# EAGLE schematic Universal Flight Computer Mk1 (EAGLE 9.0.1)

## Sheet 1 of 2
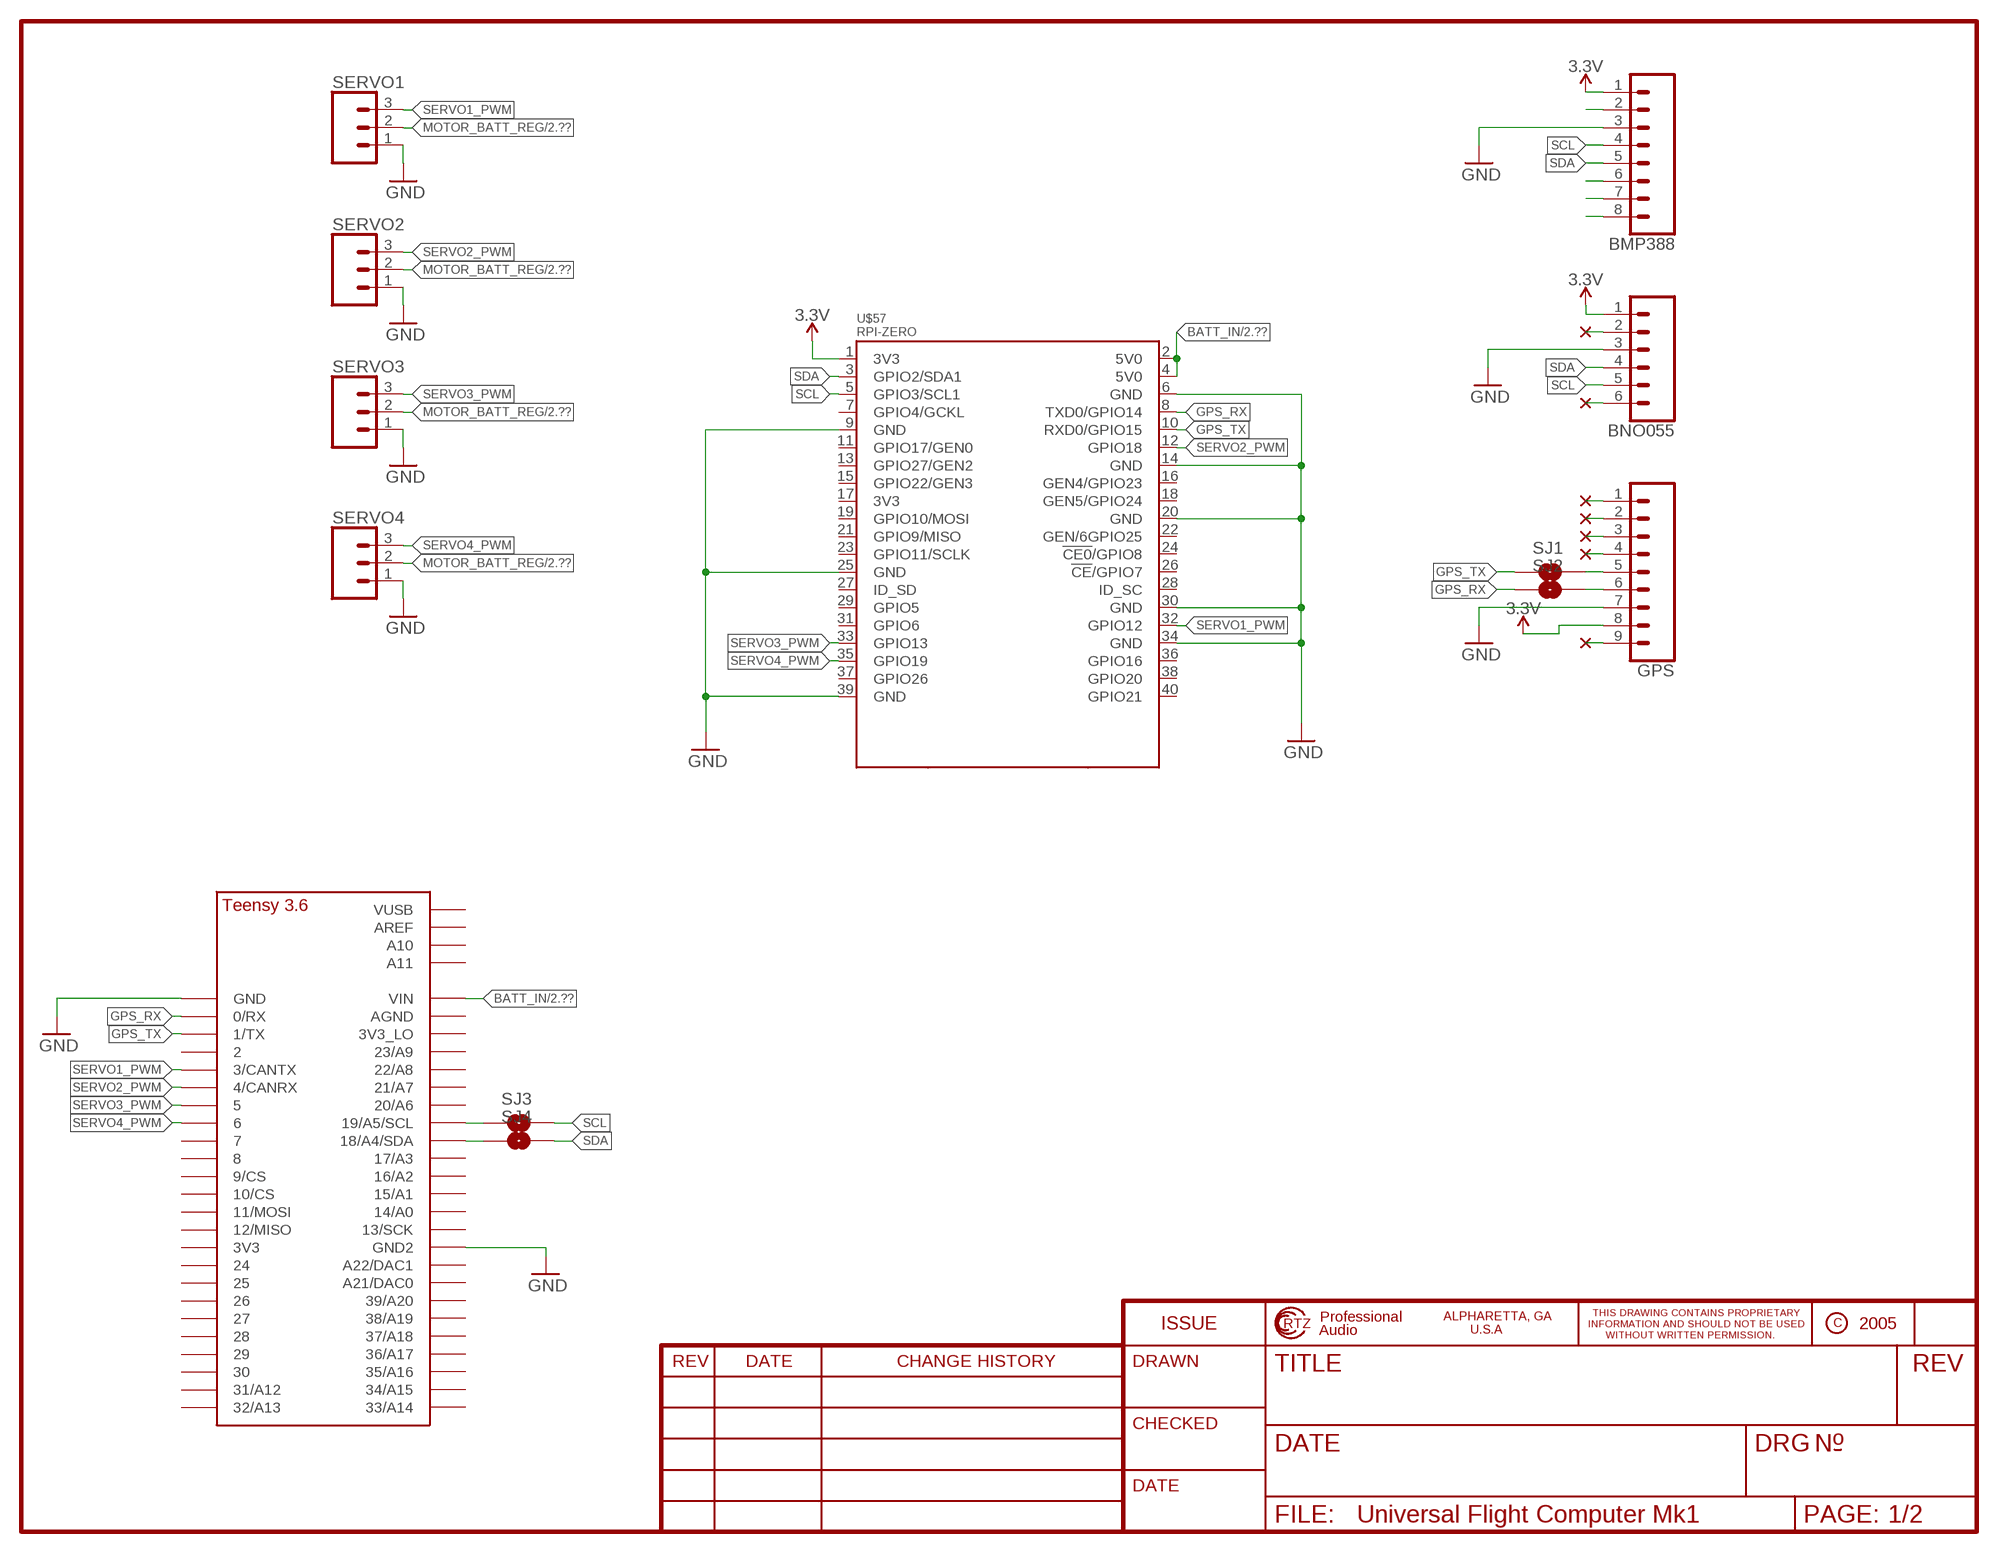
[diagram p0: schematic, sheet 1]

### Parts
BMP388  CONN_08"  [1X08]
BNO055  CONN_06SILK_FEMALE_PTH  [1X06]
GPS  CONN_09  [1X09]
SERVO1  CONN_03  [1X03]
SERVO2  CONN_03  [1X03]
SERVO3  CONN_03  [1X03]
SERVO4  CONN_03  [1X03]
SJ1  SOLDERJUMPERNO  [SJ_2S-NO]
SJ2  SOLDERJUMPERNO  [SJ_2S-NO]
SJ3  SOLDERJUMPERNO  [SJ_2S-NO]
SJ4  SOLDERJUMPERNO  [SJ_2S-NO]
U$5  NC  [NC]
U$6  NC  [NC]
U$7  NC  [NC]
U$8  NC  [NC]
U$9  NC  [NC]
U$10  NC  [NC]
U$11  NC  [NC]
U$12  TEENSY_3.5/3.6_BASIC  [TEENSY_3.5/3.6_BASIC]
U$57  RPI-ZERO  [RASPBERRYPI_BASTELSTUBE_V13_RASPI_BOARD_B+_FULL]

### Nets
3.3V: BMP388.1 BNO055.1 GPS.8 U$57.1(3V3)
BATT_IN: U$12.VIN U$57.2(5V0) U$57.4(5V0) ; also sheet 2
BMP_CS: BMP388.7
BMP_INT: BMP388.8
BMP_SDI: BMP388.6
GND: BMP388.3 BNO055.3 GPS.7 SERVO1.1 SERVO2.1 SERVO3.1 SERVO4.1 U$12.GND U$12.GND2 U$57.6(GND) U$57.9(GND) U$57.14(GND) U$57.20(GND) U$57.25(GND) U$57.30(GND) U$57.34(GND) U$57.39(GND) ; also sheet 2
GPS_RX: GPS.6 SJ2.1 SJ2.2 U$12.0/RX U$57.8(TXD0/GPIO14)
GPS_TX: GPS.5 SJ1.1 SJ1.2 U$12.1/TX U$57.10(RXD0/GPIO15)
MOTOR_BATT_REG [IGNITER_BATT_REG]: SERVO1.2 SERVO2.2 SERVO3.2 SERVO4.2 ; also sheet 2
N$1: BMP388.2
N$2: BNO055.2
N$3: GPS.1
N$4: GPS.2
N$5: GPS.3
N$6: BNO055.6
N$7: GPS.4
N$8: GPS.9
N$9: SJ3.1 U$12.19/A5/SCL
N$10: SJ4.1 U$12.18/A4/SDA
SCL: BMP388.4 BNO055.5 SJ3.2 U$57.5(GPIO3/SCL1)
SDA: BMP388.5 BNO055.4 SJ4.2 U$57.3(GPIO2/SDA1)
SERVO1_PWM: SERVO1.3 U$12.3/CANTX U$57.32(GPIO12)
SERVO2_PWM: SERVO2.3 U$12.4/CANRX U$57.12(GPIO18)
SERVO3_PWM: SERVO3.3 U$12.5 U$57.33(GPIO13)
SERVO4_PWM: SERVO4.3 U$12.6 U$57.35(GPIO19)
Unconnected: U$12.2 U$12.3V3 U$12.3V3_LO U$12.7 U$12.8 U$12.9/CS U$12.10/CS U$12.11/MOSI U$12.12/MISO U$12.13/SCK U$12.14/A0 U$12.15/A1 U$12.16/A2 U$12.17/A3 U$12.20/A6 U$12.21/A7 U$12.21/DAC0(A21/DAC0) U$12.22/A8 U$12.23/A9 U$12.24 U$12.25 U$12.26 U$12.27 U$12.28 U$12.29 U$12.30 U$12.31/A12 U$12.32/A13 U$12.33/A14 U$12.34/A15 U$12.35/A16 U$12.36/A17 U$12.37/A18 U$12.38/A19 U$12.39/A20 U$12.A10 U$12.A11 U$12.A22/DAC1 U$12.AGND U$12.AREF U$12.VUSB U$57.7(GPIO4/GCKL) U$57.11(GPIO17/GEN0) U$57.13(GPIO27/GEN2) U$57.15(GPIO22/GEN3) U$57.16(GEN4/GPIO23) U$57.17(3V3) U$57.18(GEN5/GPIO24) U$57.19(GPIO10/MOSI) U$57.21(GPIO9/MISO) U$57.22(GEN/6GPIO25) U$57.23(GPIO11/SCLK) U$57.24(!CE0!/GPIO8) U$57.26(!CE!/GPIO7) U$57.27(ID_SD) U$57.28(ID_SC) U$57.29(GPIO5) U$57.31(GPIO6) U$57.36(GPIO16) U$57.37(GPIO26) U$57.38(GPIO20) U$57.40(GPIO21)

## Sheet 2 of 2
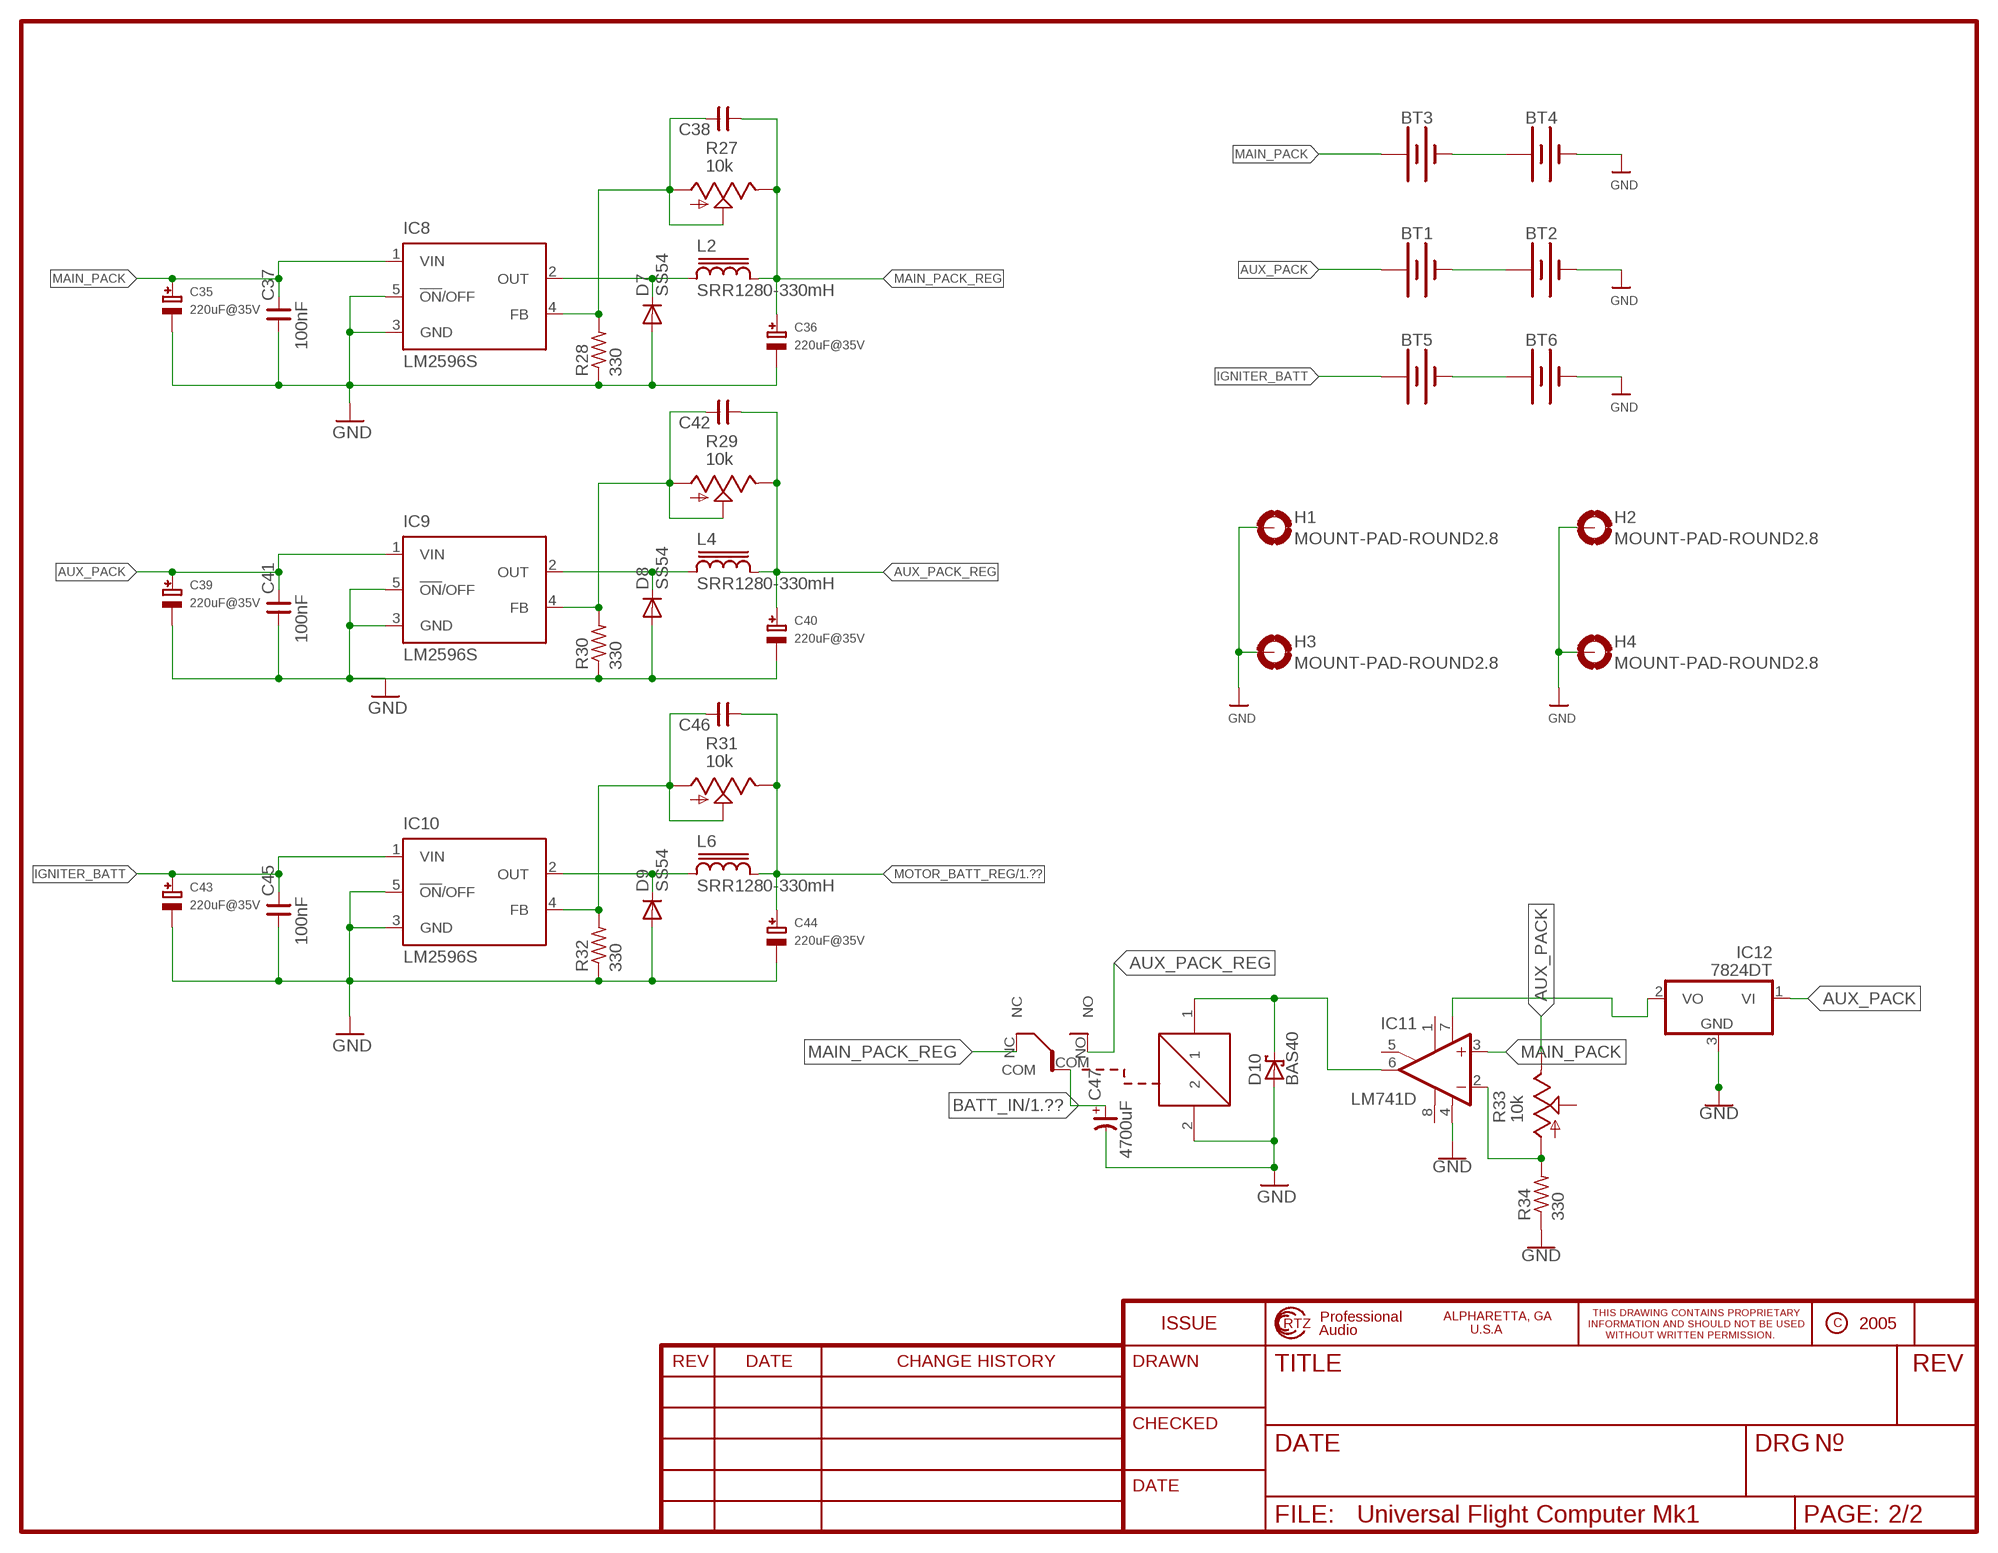
[diagram p1: schematic, sheet 2]

### Parts
BT1  BATTERY-18650  [BATTERY_18650-HOLDER]
BT2  BATTERY-18650  [BATTERY_18650-HOLDER]
BT3  BATTERY-18650  [BATTERY_18650-HOLDER]
BT4  BATTERY-18650  [BATTERY_18650-HOLDER]
BT5  BATTERY-18650  [BATTERY_18650-HOLDER]
BT6  BATTERY-18650  [BATTERY_18650-HOLDER]
C35  220uF@35V  CAP_ELECTROLYTICPANASONIC_D  [PANASONIC_D]
C36  220uF@35V  CAP_ELECTROLYTICPANASONIC_D  [PANASONIC_D]
C37  100nF  CNP-0603  [0603]
C38  CNP-0603  [0603]
C39  220uF@35V  CAP_ELECTROLYTICPANASONIC_D  [PANASONIC_D]
C40  220uF@35V  CAP_ELECTROLYTICPANASONIC_D  [PANASONIC_D]
C41  100nF  CNP-0603  [0603]
C42  CNP-0603  [0603]
C43  220uF@35V  CAP_ELECTROLYTICPANASONIC_D  [PANASONIC_D]
C44  220uF@35V  CAP_ELECTROLYTICPANASONIC_D  [PANASONIC_D]
C45  100nF  CNP-0603  [0603]
C46  CNP-0603  [0603]
C47  4700uF  CP-E-025X065  [E-025X065]
D7  SS54  S3G  [DO214AB]
D8  SS54  S3G  [DO214AB]
D9  SS54  S3G  [DO214AB]
D10  BAS40  [SOT23]
H1  MOUNT-PAD-ROUND2.8  [2,8-PAD]
H2  MOUNT-PAD-ROUND2.8  [2,8-PAD]
H3  MOUNT-PAD-ROUND2.8  [2,8-PAD]
H4  MOUNT-PAD-ROUND2.8  [2,8-PAD]
IC8  LM2596S  [TO263-5]
IC9  LM2596S  [TO263-5]
IC10  LM2596S  [TO263-5]
IC11  LM741D  [SO08]
IC12  7824DT  [TO252]
L2  SRR1280-330mH  SRR1280  [SRR1280]
L4  SRR1280-330mH  SRR1280  [SRR1280]
L6  SRR1280-330mH  SRR1280  [SRR1280]
R27  10k  TRIM_US-S64W  [S64W]
R28  330  R-US_R0603  [R0603]
R29  10k  TRIM_US-S64W  [S64W]
R30  330  R-US_R0603  [R0603]
R31  10k  TRIM_US-S64W  [S64W]
R32  330  R-US_R0603  [R0603]
R33  10k  TRIM_US-S64W  [S64W]
R34  330  R-US_R0603  [R0603]
U$54  RW-SH  [RW-SH]

### Nets
AUX_PACK [AUX_PACK]: BT1.PWR@1(+) C39.+ C41.2 IC9.1(VIN) IC12.1(VI) R33.E
AUX_PACK_REG [AUX_PACK_REG]: C40.+ C42.1 L4.2 R29.E U$54.NO
BATT_IN: C47.+ D10.3(C) IC11.6(OUT) U$54.1 U$54.COM ; also sheet 1
GND: BT2.GND@1(-) BT4.GND@1(-) BT6.GND@1(-) C39.- C40.- C41.1 C43.- C44.- C45.1 D8.A D9.A D10.1(A) H1.B2,8(MOUNT) H2.B2,8(MOUNT) H3.B2,8(MOUNT) H4.B2,8(MOUNT) IC9.3(GND) IC9.5(!ON!/OFF) IC10.3(GND) IC10.5(!ON!/OFF) IC11.4(V-) IC12.3(GND) R30.1 R32.1 R34.1 U$54.2 ; also sheet 1
IGNITER_BATT [IGNITER_BATT]: BT5.PWR@1(+) C43.+ C45.2 IC10.1(VIN)
MAIN_PACK [MAIN_PACK]: BT3.PWR@1(+) C35.+ C35.- C36.- C37.1 C37.2 D7.A IC8.1(VIN) IC8.3(GND) IC8.5(!ON!/OFF) IC11.3(+IN) R28.1 ; supply symbol labelled GND
MAIN_PACK_REG [MAIN_PACK_REG]: C36.+ C38.1 L2.2 R27.E U$54.NC
MOTOR_BATT_REG [IGNITER_BATT_REG]: C44.+ C46.1 L6.2 R31.E ; also sheet 1
N$43: BT3.GND@1(-) BT4.PWR@1(+)
N$44: BT1.GND@1(-) BT2.PWR@1(+)
N$56: D7.C IC8.2(OUT) L2.1
N$59: C38.2 IC8.4(FB) R27.A R27.S R28.2
N$63: D8.C IC9.2(OUT) L4.1
N$68: C42.2 IC9.4(FB) R29.A R29.S R30.2
N$69: D9.C IC10.2(OUT) L6.1
N$70: C46.2 IC10.4(FB) R31.A R31.S R32.2
N$71: IC11.2(-IN) R33.A R34.2
N$72: IC11.7(V+) IC12.2(VO)
N$73: BT5.GND@1(-) BT6.PWR@1(+)
Unconnected: C47.- IC11.1(ON1) IC11.5(ON2) IC11.8(OPT) R33.S

## Library data of the parts
BMP388 = SparkFun-Connectors:CONN_08: Multi connection point. Often used as Generic Header-pin footprint for 0.1 inch spaced/style header connections On any of the 0.1 inch spaced packages, you can populate with these: Break Away Headers - Straight <https://www.sparkfun.com/products/116> (PRT-00116) Break Away Male Headers - Right Angle <https://www.sparkfun.com/products/553> (PRT-00553) Female Headers <https://www.sparkfun.com/products/115> (PRT-00115) Break Away Headers - Machine Pin <https://www.sparkfun.com/products/117> (PRT-00117) Break Away Female Headers - Swiss Machine Pin <https://www.sparkfun.com/products/743> (PRT-00743) Arduino Stackable Header - 8 Pin <https://www.sparkfun.com/products/9279> (PRT-09279) For SCREWTERMINALS and SPRING TERMINALS visit here: Screw Terimnals on SparkFun.com <https://www.sparkfun.com/search/results?term=Screw+Terminals> (5mm/3.5mm/2.54mm spacing) This device is also useful as a general connection point to wire up your design to another part of your project. Our various solder wires solder well into these plated through hole pads. Hook-Up Wire - Assortment (Stranded, 22 AWG) <https://www.sparkfun.com/products/11375> (PRT-11375) Hook-Up Wire - Assortment (Solid Core, 22 AWG) <https://www.sparkfun.com/products/11367> (PRT-11367) View the entire wire category on our website here <https://www.sparkfun.com/categories/141> Special notes: Molex polarized connector foot print use with SKU : PRT-08231 with associated crimp pins and housings. 1MM SMD Version SKU: PRT-10208 NOTES ON THE VARIANTS LOCK and LOCK_LONGPADS... This footprint was designed to help hold the alignment of a through-hole component (i.e. 6-pin header) while soldering it into place. You may notice that each hole has been shifted either up or down by 0.005 of an inch from it's more standard position (which is a perfectly straight line). This slight alteration caused the pins (the squares in the middle) to touch the edges of the holes. Because they are alternating, it causes a "brace" to hold the component in place. 0.005 has proven to be the perfect amount of "off-center" position when using our standard breakaway headers. Although looks a little odd when you look at the bare footprint, once you have a header in there, the alteration is very hard to notice. Also,if you push a header all the way into place, it is covered up entirely on the bottom side.; PROD_ID: CONN-08438
BNO055 = SparkFun-Connectors:CONN_06: Multi connection point. Often used as Generic Header-pin footprint for 0.1 inch spaced/style header connections On any of the 0.1 inch spaced packages, you can populate with these: Break Away Headers - Straight <https://www.sparkfun.com/products/116> (PRT-00116) Break Away Male Headers - Right Angle <https://www.sparkfun.com/products/553> (PRT-00553) Female Headers <https://www.sparkfun.com/products/115> (PRT-00115) Break Away Headers - Machine Pin <https://www.sparkfun.com/products/117> (PRT-00117) Break Away Female Headers - Swiss Machine Pin <https://www.sparkfun.com/products/743> (PRT-00743) Arduino Stackable Header - 6 Pin <https://www.sparkfun.com/products/9280> (PRT-09280) For SCREWTERMINALS and SPRING TERMINALS visit here: Screw Terimnals on SparkFun.com <https://www.sparkfun.com/search/results?term=Screw+Terminals> (5mm/3.5mm/2.54mm spacing) This device is also useful as a general connection point to wire up your design to another part of your project. Our various solder wires solder well into these plated through hole pads. Hook-Up Wire - Assortment (Stranded, 22 AWG) <https://www.sparkfun.com/products/11375> (PRT-11375) Hook-Up Wire - Assortment (Solid Core, 22 AWG) <https://www.sparkfun.com/products/11367> (PRT-11367) View the entire wire category on our website here <https://www.sparkfun.com/categories/141>; PROD_ID: CONN-08437
BT1-BT6 = SparkFun-Batteries:BATTERY: Battery - Single Cell A variety of battery chemistries, sizes, and footprints. Device List: 20MM_PTH - Coin Cell Battery Holder - 20mm (PTH) <https://www.sparkfun.com/products/783> 6.8MM_PTH - Coin Cell Battery Holder - 6.8MM(SMD) <https://www.digikey.com/product-detail/en/seiko-instruments/MS621FE-FL11E/728-1057-ND/1889208?WT.srch=1&gclid=CNOQ5a6LzdQCFZS2wAodXCkE0g> 12MM_SMD - Coin Cell Battery Holder - 12mm (SMD) <https://www.sparkfun.com/products/10592> 12MM_PTH - Coin Cell Battery Holder - 12mm (PTH) <https://www.sparkfun.com/products/7948> 20MM_SMD - 20mm Coin Cell Battery Holder (SMD) (2 legs) Used on the Big Time Watch Kit <https://www.sparkfun.com/products/11734> 20MM_SMD_4LEGS - Coin Cell Battery Holder - 20mm (SMD) <https://www.sparkfun.com/products/11892> 20MM_SMD_4LEGS_OVERPASTE - Coin Cell Battery Holder - 20mm (SMD) <https://www.sparkfun.com/products/11892> (Over-paste on the legs) 24.5MM_PTH - Coin Cell Battery Holder - 24.5mm (PTH) <https://www.sparkfun.com/products/8863> 9V - 9V Battery Holder - PC Mount Used on the SparkFun SparkPunk Sound Kit <https://www.sparkfun.com/products/11177> and SparkFun SparkPunk Sequencer Kit <https://www.sparkfun.com/products/12707> 18650 - Battery Holder - 18650 (PTH) <https://www.sparkfun.com/products/13113> AA - Battery Holder - 1xAA (PTH) <https://www.sparkfun.com/products/7949> AAA - Battery Holder - 1xAAA (PTH) <https://www.sparkfun.com/products/12718> AA_KIT - Battery Holder - 1xAA (PTH) <https://www.sparkfun.com/products/7949> Special kit package - pads only have exposed copper on one side of the board. AAA_KIT - Battery Holder - 1xAAA (PTH) <https://www.sparkfun.com/products/12718> Special kit package - pads only have exposed copper on one side of the board.; PROD_ID: BATT-12327; SF_SKU: PRT-13113
C35 C36 C39 C40 C43 C44 = microbuilder:CAP_ELECTROLYTIC: Electrolytic Capacitors PANASONIC_C - Size C Panasonic Electrolytic Aluminum Capacitor 47µF 16V 20% Electrolytic Capacitor [Digikey: PCE3890TR-ND] PANASONIC_D - Size D Panasonic Electrolytic Aluminum Capacitor 100µF 25V 20% Electrolytic Capacitor [Digikey: PCE3898TR-ND]
C37 C38 C41 C42 C45 C46 = cap-master:CNP-: NON-POLARIZED CAP
C47 = cap-master:CP-: POLARIZED CAP
D7-D9 = s3x_10:S3*: S3A - S3N General Purpose Rectifiers Source: http://www.fairchildsemi.com/datasheets/S3/S3A.pdf; MF: Fairchild; MPN: S3G; OC_FARNELL: 2454094; OC_NEWARK: 58K2397
D10 = diode:BAS40: Silicon Schottky Diodes General-purpose diode for high-speed switching
GPS = SparkFun-Connectors:CONN_09: Multi connection point. Often used as Generic Header-pin footprint for 0.1 inch spaced/style header connections On any of the 0.1 inch spaced packages, you can populate with these: Break Away Headers - Straight <https://www.sparkfun.com/products/116> (PRT-00116) Break Away Male Headers - Right Angle <https://www.sparkfun.com/products/553> (PRT-00553) Female Headers <https://www.sparkfun.com/products/115> (PRT-00115) Break Away Headers - Machine Pin <https://www.sparkfun.com/products/117> (PRT-00117) Break Away Female Headers - Swiss Machine Pin <https://www.sparkfun.com/products/743> (PRT-00743) For SCREWTERMINALS and SPRING TERMINALS visit here: Screw Terimnals on SparkFun.com <https://www.sparkfun.com/search/results?term=Screw+Terminals> (5mm/3.5mm/2.54mm spacing) This device is also useful as a general connection point to wire up your design to another part of your project. Our various solder wires solder well into these plated through hole pads. Hook-Up Wire - Assortment (Stranded, 22 AWG) <https://www.sparkfun.com/products/11375> (PRT-11375) Hook-Up Wire - Assortment (Solid Core, 22 AWG) <https://www.sparkfun.com/products/11367> (PRT-11367) View the entire wire category on our website here <https://www.sparkfun.com/categories/141> Special notes: Molex polarized connector foot print use with SKU : PRT-08231 with associated crimp pins and housings. 1MM SMD Version SKU: PRT-10208 NOTES ON THE VARIANTS LOCK and LOCK_LONGPADS... This footprint was designed to help hold the alignment of a through-hole component (i.e. 6-pin header) while soldering it into place. You may notice that each hole has been shifted either up or down by 0.005 of an inch from it's more standard position (which is a perfectly straight line). This slight alteration caused the pins (the squares in the middle) to touch the edges of the holes. Because they are alternating, it causes a "brace" to hold the component in place. 0.005 has proven to be the perfect amount of "off-center" position when using our standard breakaway headers. Although looks a little odd when you look at the bare footprint, once you have a header in there, the alteration is very hard to notice. Also,if you push a header all the way into place, it is covered up entirely on the bottom side.
H1-H4 = holes:MOUNT-PAD-ROUND: MOUNTING PAD, round
IC8-IC10 = national-semiconductor:LM2596: SIMPLE SWITCHER® Power Converter 150 kHz 3A Step-Down Voltage Regulator Source: http://www.national.com/ds/LM/LM2596.pdf; MF: NATIONAL SEMICONDUCTOR; MPN: LM2596S-ADJ/NOPB; OC_FARNELL: 9494367; OC_NEWARK: 41K3842
IC11 = linear:*741: OP AMP
IC12 = linear:78*: Positive VOLTAGE REGULATOR Source: http://cache.national.com/ds/LM/LM78L05.pdf http://www.fairchildsemi.com/ds/LM/LM7805.pdf
L2 L4 L6 = inductor-bourns:SRR1280: POWER INDUCTOR
R27 R29 R31 R33 = pot:TRIM_US-: POTENTIOMETER
R28 R30 R32 R34 = adafruit:R-US_: RESISTOR, American symbol
SERVO1-SERVO4 = SparkFun-Connectors:CONN_03: Multi connection point. Often used as Generic Header-pin footprint for 0.1 inch spaced/style header connections On any of the 0.1 inch spaced packages, you can populate with these: Break Away Headers - Straight <https://www.sparkfun.com/products/116> (PRT-00116) Break Away Male Headers - Right Angle <https://www.sparkfun.com/products/553> (PRT-00553) Female Headers <https://www.sparkfun.com/products/115> (PRT-00115) Break Away Headers - Machine Pin <https://www.sparkfun.com/products/117> (PRT-00117) Break Away Female Headers - Swiss Machine Pin <https://www.sparkfun.com/products/743> (PRT-00743) Stackable Header - 3 Pin (Female, 0.1") <https://www.sparkfun.com/products/13875> (PRT-13875) For SCREWTERMINALS and SPRING TERMINALS visit here: Screw Terimnals on SparkFun.com <https://www.sparkfun.com/search/results?term=Screw+Terminals> (5mm/3.5mm/2.54mm spacing) This device is also useful as a general connection point to wire up your design to another part of your project. Our various solder wires solder well into these plated through hole pads. Hook-Up Wire - Assortment (Stranded, 22 AWG) <https://www.sparkfun.com/products/11375> (PRT-11375) Hook-Up Wire - Assortment (Solid Core, 22 AWG) <https://www.sparkfun.com/products/11367> (PRT-11367) View the entire wire category on our website here <https://www.sparkfun.com/categories/141> Special notes: Molex polarized connector foot print use with SKU : PRT-08232 with associated crimp pins and housings.
SJ1-SJ4 = SparkFun:SOLDERJUMPER: Solder Jumper Standard SMD solder jumper. Used to automate production. Two varients : Normally Open and Normally Closed are the same, but have different paste layers. NC will have a large amount of paste and should jumper during reflow.
U$5-U$11 = divers:NC: No connect symbol
U$12 = Teensy356:TEENSY_3.5/3.6_BASIC
U$54 = goodsky1:RW-SH
U$57 = RPI-Zero:RPI-ZERO

## Net classes
0 default: width 0.203 mm, drill 0.254 mm, clearance 0.127 mm
1 16mil: width 0.254 mm, drill 0.254 mm, clearance 0.127 mm
2 MAIN_PACK: width 0.813 mm
3 32mil: width 0.254 mm, drill 0.254 mm, clearance 0.127 mm
4 AUX_PACK: width 0.813 mm
5 IGNITER_BATT: width 0.813 mm
6 MAIN_PACK_REG: width 0.813 mm
7 AUX_PACK_REG: width 0.813 mm
8 IGNITER_BATT_REG: width 0.813 mm